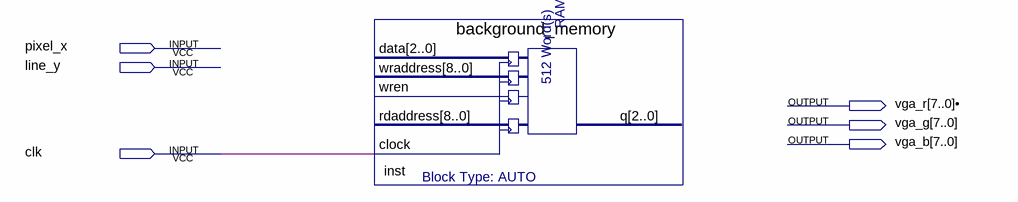
[diagram p0: schematic sheet]
// Quartus schematic image_generator.bdf as structural Verilog: 1 symbols, 6 pins
module image_generator (
  input  pixel_x,
  input  line_y,
  input  clk,
  output \vga_r[7..0]• ,
  output [7:0] vga_g,
  output [7:0] vga_b
);

  background_memory inst (.clock(clk));  // open: data, wraddress, wren, rdaddress, q
endmodule
